# Altium schematic sheet Connectors.SchDoc: Connectors
size Letter; DocumentNumber: 11; SheetNumber: 11; SheetTotal: 11
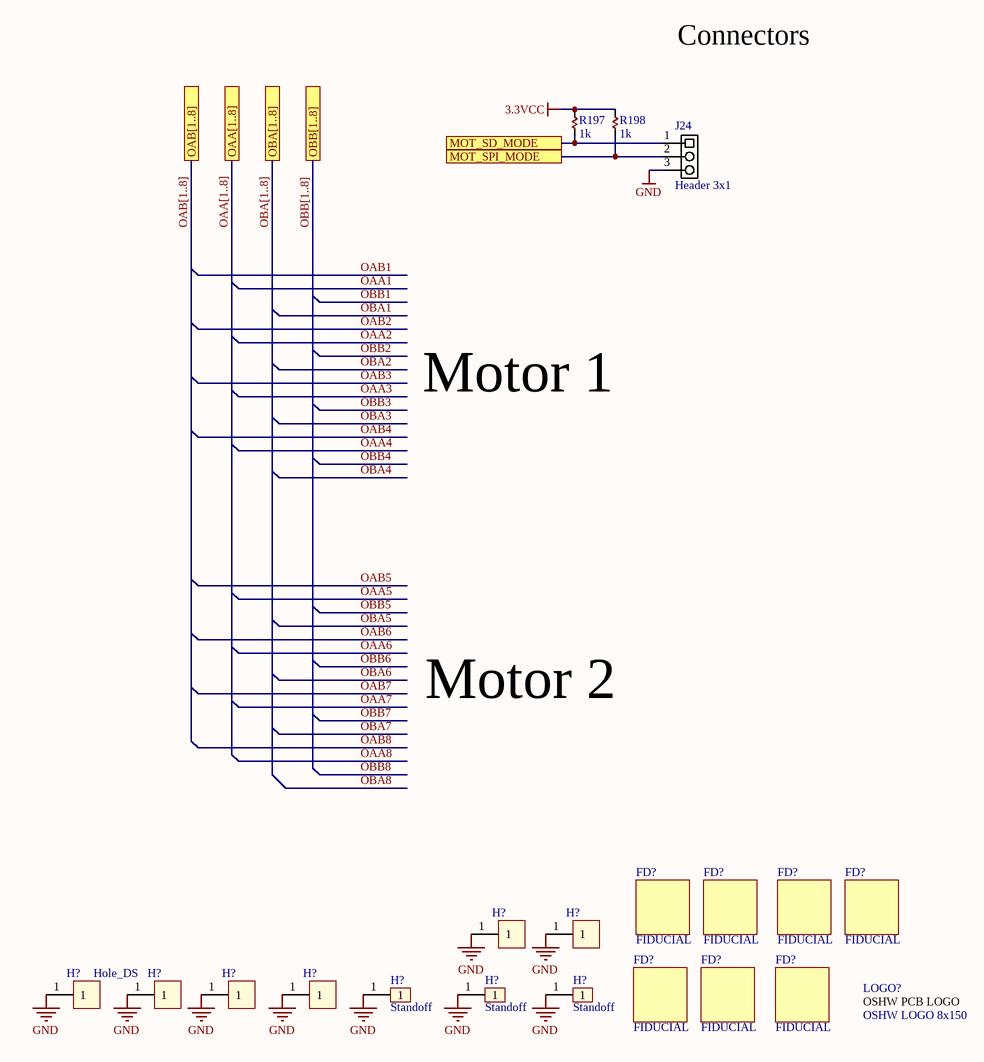
[diagram p0: Connectors.SchDoc]

## Parts
(Parts that share a designator on the sheet are numbered #1, #2 ... from top to bottom, then left to right.)
FD?#1  FIDUCIAL  [FIDUCIAL-1X2]
FD?#2  FIDUCIAL  [FIDUCIAL-1X2]
FD?#3  FIDUCIAL  [FIDUCIAL-1X2]
FD?#4  FIDUCIAL  [FIDUCIAL-1X2]
FD?#5  FIDUCIAL  [FIDUCIAL-1X2]
FD?#6  FIDUCIAL  [FIDUCIAL-1X2]
FD?#7  FIDUCIAL  [FIDUCIAL-1X2]
H?#1  Hole_DS  [Wave_hole_3x7-doubleSided]  (value not drawn)  (no BOM)
H?#2  Hole_DS  [Wave_hole_3x7-doubleSided]  (value not drawn)  (no BOM)
H?#3  Hole_DS  [Wave_hole_3x7-doubleSided]  (no BOM)
H?#4  Hole_DS  [Wave_hole_3x7-doubleSided]  (value not drawn)  (no BOM)
H?#5  Hole_DS  [Wave_hole_3x7-doubleSided]  (value not drawn)  (no BOM)
H?#6  Hole_DS  [Wave_hole_3x7-doubleSided]  (value not drawn)  (no BOM)
H?#7  Standoff  [Standoff3mmTopConn]  (no BOM)
H?#8  Standoff  [Standoff3mmTopConn]  (no BOM)
H?#9  Standoff  [Standoff3mmTopConn]  (no BOM)
J24  Header 3x1  [HDR3X1]
LOGO?  OSHW LOGO 8x150  [OSHW_8X150_NOTEXT]  (no BOM)
R197  1k  [R0402]
R198  1k  [R0402]

## Ports
MOT_SD_MODE, MOT_SPI_MODE, OAA[1..8], OAB[1..8], OBA[1..8], OBB[1..8]

## Nets
3.3VCC: R197.2 R198.2
GND: H?#1.1 H?#2.1 H?#3.1 H?#4.1 H?#5.1 H?#6.1 H?#7.1 H?#8.1 H?#9.1 J24.3
MOT_SD_MODE: J24.1 R197.1 ; port MOT_SD_MODE
MOT_SPI_MODE: J24.2 R198.1 ; port MOT_SPI_MODE

## Buses and harness runs
bus OAA[1..8] = port OAA[1..8]
bus OAB[1..8] = port OAB[1..8]
bus OBA[1..8] = port OBA[1..8]
bus OBB[1..8] = port OBB[1..8]

## Notes on the sheet
- Connectors
- Motor 1
- Motor 2
- Title:
- Project:
- File:
- Ver:
- Drawn by:
- Sheet:
- of
- (in symbol OSHW LOGO 8x150) OSHW PCB LOGO

## Library data of the parts
FD?#1-FD?#7 = FIDUCIAL: MANUFACTURER #: NOTAPART-Fiducial; PART: NOTAPART-Fiducial
H?#1-H?#6 = Hole_DS: MANUFACTURER #: NOTAPART-Hole; PART: NOTAPART-Hole
H?#7-H?#9 = Standoff3TopConn: Mechanical - Top connect; MANUFACTURER #: NOTAPART-Hole; PART: NOTAPART-Hole
J24 = Header 3x1 Male Pin: Header 3Pin 1Row T-Hole; MANUFACTURER #: 2211S-03G; MANUFACTURER: Multicomp; PART DESCRIPTION: MULTICOMP  2211S-03G  Board-To-Board Connector, 2.54 mm, 3 Contacts, Header, 2211S Series, Through Hole, 1 Rows; TOLERANCE: -NA-; VALUE: JMP; DISTRIBUTOR #: 08N6745; DISTRIBUTOR: Newark; PART: 2211S-03G; EE_SPEC: -NA-
LOGO? = OSHW LOGO 8x150: MANUFACTURER #: NOTAPART-OSHW LOGO; PART: NOTAPART-OSHW LOGO
R197 R198 = 1k 1% 0402: RES 0402 1k 63mW 1%; MANUFACTURER: Yageo; MANUFACTURER #: RC0402FR-071KL; PART DESCRIPTION: 1k Ohm ±1% 0.063W, 1/16W Chip Resistor 0402 (1005 Metric) Moisture Resistant Thick Film; EE_SPEC: 1/16W; VALUE: 1k; DISTRIBUTOR #: 311-1.00KLRTR-ND; DISTRIBUTOR: Digikey; PART: RC0402FR-071KL; TOLERANCE: 1%